# Altium schematic sheet LaserTagNeopixelBoard.SchDoc
size A; SheetNumber: 3; SheetTotal: 3
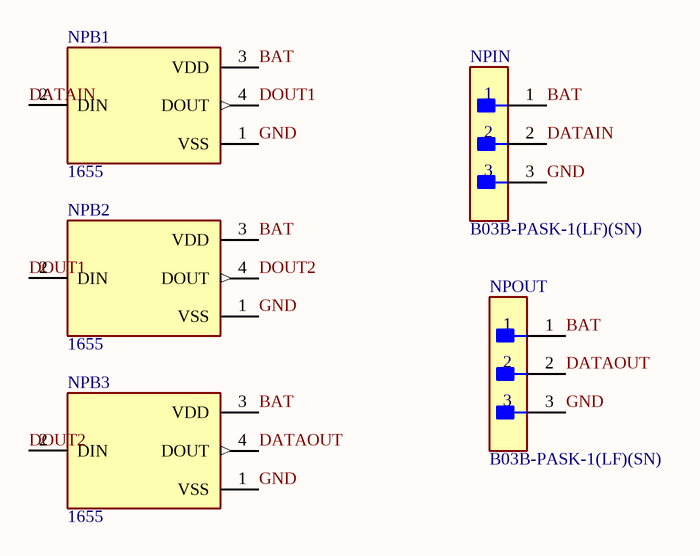
[diagram p0: LaserTagNeopixelBoard.SchDoc]

## Parts
NPB1  1655  [LED_1655]
NPB2  1655  [LED_1655]
NPB3  1655  [LED_1655]
NPIN  B03B-PASK-1(LF)(SN)  [FP-B03B-PASK-1_LF_SN-MFG]
NPOUT  B03B-PASK-1(LF)(SN)  [FP-B03B-PASK-1_LF_SN-MFG]

## Nets
BAT: NPB1.3(VDD) NPB2.3(VDD) NPB3.3(VDD) NPIN.1 NPOUT.1
DATAIN: NPB1.2(DIN) NPIN.2
DATAOUT: NPB3.4(DOUT) NPOUT.2
DOUT1: NPB1.4(DOUT) NPB2.2(DIN)
DOUT2: NPB2.4(DOUT) NPB3.2(DIN)
GND: NPB1.1(VSS) NPB2.1(VSS) NPB3.1(VSS) NPIN.3 NPOUT.3

## Library data of the parts
NPB1-NPB3 = 1655: Ws2812b 5050 Rgb Led With Integrated Driver Chip Pack Of 10; Package: None; MP: 1655; Price: None; Availability: Unavailable; Value: *
NPIN NPOUT = CMP-17439-000193-1: CONN HEADER VERT 3POS 2MM; Voltage Rating: 250V; Current Rating: 3A; Mated Stacking Heights: 14.9mm; Number of Positions: 3; Packaging: Bulk; Contact Type: Male Pin; Flammability Rating: UL94 V-0; Contact Shape: Square; Number of Rows: 1; Color: Natural; Orientation: Straight; Housing Color: White; Fastening Type: Ramp; Insulation Material: PBT; Insulation Color: Natural; Mount: Through Hole; Contact Finish - Mating: TIN; Connector Type: Header; Termination: Solder; Contact Mating Length: 0.126inch; Lead Free: Lead Free; Contact Material: Copper Alloy; Pitch: 2mm; Series: PA; Number of Contacts: 3; Contact Plating: Tin